# Altium project 指纹锁pcb.PrjPcb
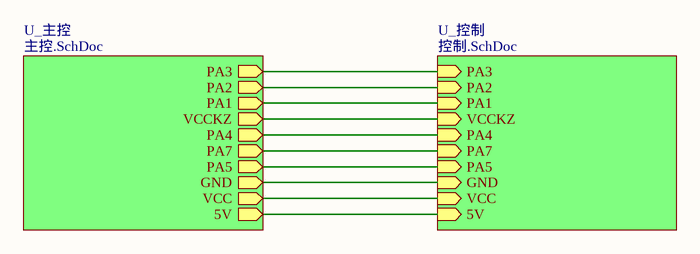
[diagram p0: 指纹锁.SchDoc]
3 sheets, 19 parts. Net scope: hierarchical (ports join the sheet entries above them; power ports are global).
Board file: 指纹锁PCB_2as.PcbDoc
Sheets:
  指纹锁.SchDoc
    U_控制 = 控制.SchDoc
    U_主控 = 主控.SchDoc

## Sheet 指纹锁.SchDoc
size A4

### Sub-sheets
U_主控 = 主控.SchDoc: PA3 (out), PA2 (out), PA1 (out), VCCKZ (out), PA4 (out), PA7 (out), PA5 (out), GND (out), VCC (out), 5V (out)
U_控制 = 控制.SchDoc: PA3 (in), PA2 (in), PA1 (in), VCCKZ (in), PA4 (in), PA7 (in), PA5 (in), GND (in), VCC (in), 5V (in)

### Nets
GND: sheet U_控制/GND, sheet U_主控/GND
VCC: sheet U_控制/VCC, sheet U_主控/VCC
5v: sheet U_控制/5V, sheet U_主控/5V
PA1: sheet U_控制/PA1, sheet U_主控/PA1
PA2: sheet U_控制/PA2, sheet U_主控/PA2
PA3: sheet U_控制/PA3, sheet U_主控/PA3
PA4: sheet U_控制/PA4, sheet U_主控/PA4
PA5: sheet U_控制/PA5, sheet U_主控/PA5
PA7: sheet U_控制/PA7, sheet U_主控/PA7
VCCKZ: sheet U_控制/VCCKZ, sheet U_主控/VCCKZ

## Sheet 控制.SchDoc
size A4
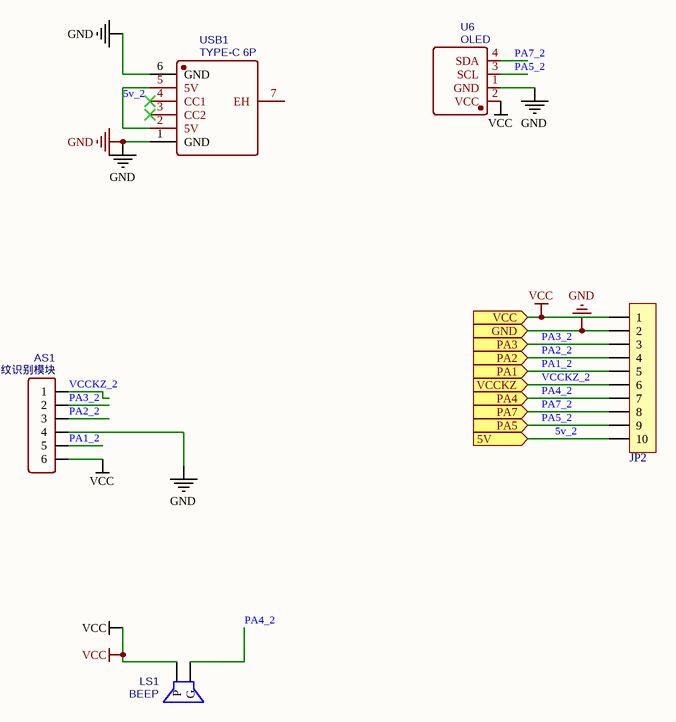
[diagram p1: 控制.SchDoc]

### Parts
AS1  指纹识别模块  [HDR2.54-WI-6P]
JP2  HDR-1X10  [MX 1.25-WI-10P]  (value not drawn)
LS1  BEEP  [BEEP 6.5x12x6]
U6  OLED  [0.96_OLED]
USB1  TYPE-C 6P  [USB-C-SMD_10P-P1.00-L6.8-W8.9]

### Ports
5V (in), GND (in), PA1 (in), PA2 (in), PA3 (in), PA4 (in), PA5 (in), PA7 (in), VCC (in), VCCKZ (in)

### Nets
GND: AS1.4 JP2.2 U6.1(GND) USB1.1(GND) USB1.6(GND) ; port GND
VCC: AS1.6 JP2.1 LS1.1(P) U6.2(VCC) ; port VCC
5v_2: JP2.10 USB1.2(5V) USB1.5(5V) ; port 5V  [project net 5v]
PA1_2: AS1.5 JP2.5 ; port PA1  [project net PA1]
PA2_2: AS1.3 JP2.4 ; port PA2  [project net PA2]
PA3_2: AS1.2 JP2.3 ; port PA3  [project net PA3]
PA4_2: JP2.7 LS1.2(G) ; port PA4  [project net PA4]
PA5_2: JP2.9 U6.3(SCL) ; port PA5  [project net PA5]
PA7_2: JP2.8 U6.4(SDA) ; port PA7  [project net PA7]
VCCKZ_2: AS1.1 JP2.6 ; port VCCKZ  [project net VCCKZ]

Not connected (* = marked no-connect by the designer): USB1 3(CC2)* 4(CC1)* 7(EH)

### Library data of the parts
AS1 = 指纹识别模块: Contributor: LCEDA_Lib; BOM_Supplier Part: C190819; BOM_Supplier: LCSC; spicePre: J; spiceSymbolName: HDR-M-2.54_1x6
JP2 = Header 10: 10P接插件; 卖家免费技术支持，联系售后: 唯一出售店铺网址https://shop463601444.taobao.com; 封装库来自淘宝卖家 ID：黄晶宝石: 其他店铺购入均为假冒，请申请退款，本店现金奖励; 优秀评价可免费更新封装库: 联系淘宝ID：黄晶宝石，获取更新版封装库; BOM名称: 10P接插件
LS1 = BEEP: Contributor: nibo; spicePre: L; spiceSymbolName: BEEP
U6 = OLED: Contributor: Sheikah; spicePre: U; spiceSymbolName: OLED
USB1 = TYPE-C 6P: BOM_Manufacturer: SHOU HAN; Contributor: youzige; BOM_Supplier: LCSC; BOM_Supplier Part: C456012; BOM_Manufacturer Part: TYPE-C 6P; spicePre: U; spiceSymbolName: TYPE-C 6P

## Sheet 主控.SchDoc
size A4
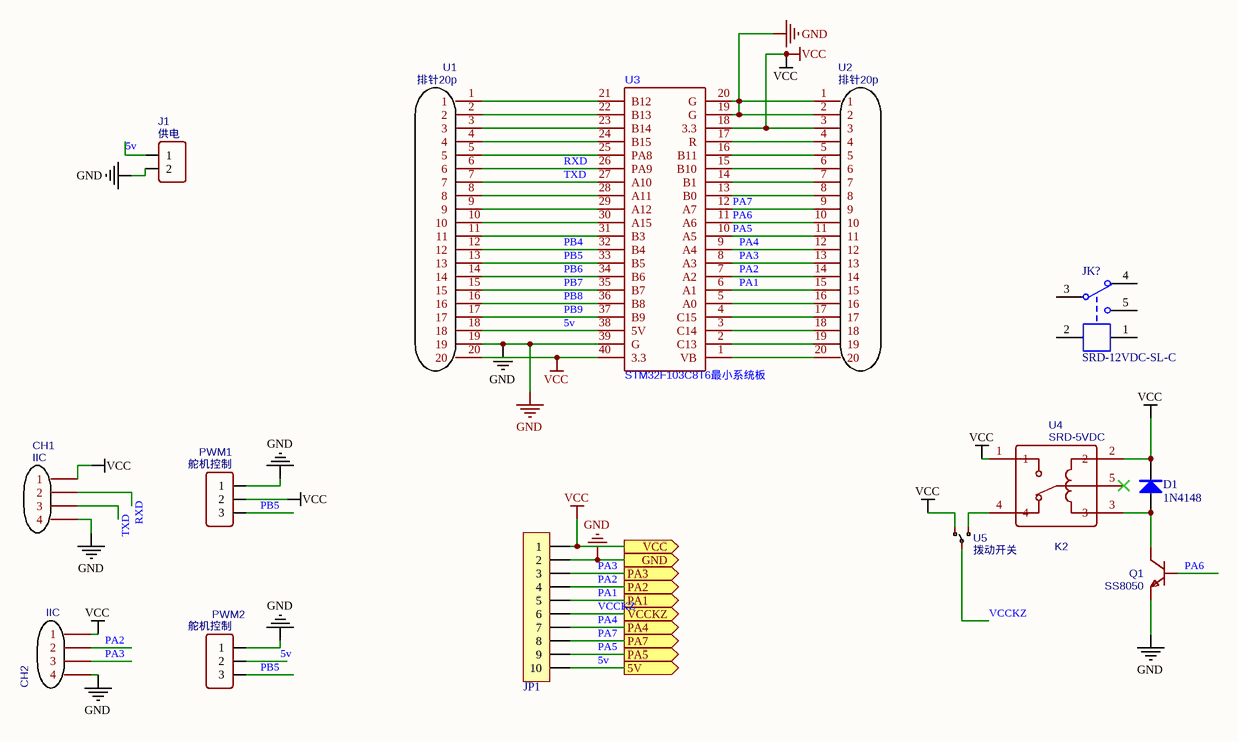
[diagram p2: 主控.SchDoc]

### Parts
CH1  IIC  [HDR2.54-LI-4P]
CH2  IIC  [HDR2.54-LI-4P]
D1  1N4148  [DO-35]
J1  供电  [HDR2.54-WI-2P]
JK?  SRD-12VDC-SL-C  [SRD-C_B]
JP1  HDR-1X10  [MX 1.25-WI-10P]  (value not drawn)
PWM1  舵机控制  [HDR2.54-WI-3P]
PWM2  舵机控制  [HDR2.54-WI-3P]
Q1  SS8050  [TO92A]
U1  排针20p  [HDR2.54-M-LI-20P]
U2  排针20p  [HDR2.54-M-LI-20P]
U3  STM32F103C8T6最小系统板  [PCBComponent_1 - duplicate]
U4  SRD-5VDC  [SRD-C_B]
U5  拨动开关  [SS12D00G3]

### Ports
5V (out), GND (out), PA1 (out), PA2 (out), PA3 (out), PA4 (out), PA5 (out), PA7 (out), VCC (out), VCCKZ (out)

### Nets
GND: CH1.4 CH2.4 J1.2 JP1.2 PWM1.1 PWM2.1 Q1.1(E) U1.19 U2.1 U2.2 U3.19(G) U3.20(G) U3.39(G) ; port GND
VCC: CH1.1 CH2.1 D1.2 JP1.1 PWM1.2 U1.20 U2.3 U3.18(3.3) U3.40(3.3) U4.1 U4.2 U5.3 ; port VCC
5v: J1.1 JP1.10 PWM2.2 U1.18 U3.38(5V) ; port 5V
PA1: JP1.5 U2.15 U3.6(A1) ; port PA1
PA2: CH2.2 JP1.4 U2.14 U3.7(A2) ; port PA2
PA3: CH2.3 JP1.3 U2.13 U3.8(A3) ; port PA3
PA4: JP1.7 U2.12 U3.9(A4) ; port PA4
PA5: JP1.9 U2.11 U3.10(A5) ; port PA5
PA6: Q1.2(B) U2.10 U3.11(A6)
PA7: JP1.8 U2.9 U3.12(A7) ; port PA7
PB4: U1.12 U3.32(B4)
PB5: PWM1.3 PWM2.3 U1.13 U3.33(B5)
PB6: U1.14 U3.34(B6)
PB7: U1.15 U3.35(B7)
PB8: U1.16 U3.36(B8)
PB9: U1.17 U3.37(B9)
RXD: CH1.2 U1.6 U3.26(PA9)
TXD: CH1.3 U1.7 U3.27(A10)
VCCKZ: JP1.6 U5.2 ; port VCCKZ
NetD1_1: D1.1 Q1.3(C) U4.3
NetU1_1: U1.1 U3.21(B12)
NetU1_2: U1.2 U3.22(B13)
NetU1_3: U1.3 U3.23(B14)
NetU1_4: U1.4 U3.24(B15)
NetU1_5: U1.5 U3.25(PA8)
NetU1_8: U1.8 U3.28(A11)
NetU1_9: U1.9 U3.29(A12)
NetU1_10: U1.10 U3.30(A15)
NetU1_11: U1.11 U3.31(B3)
NetU2_4: U2.4 U3.17(R)
NetU2_5: U2.5 U3.16(B11)
NetU2_6: U2.6 U3.15(B10)
NetU2_7: U2.7 U3.14(B1)
NetU2_8: U2.8 U3.13(B0)
NetU2_16: U2.16 U3.5(A0)
NetU2_17: U2.17 U3.4(C15)
NetU2_18: U2.18 U3.3(C14)
NetU2_19: U2.19 U3.2(C13)
NetU2_20: U2.20 U3.1(VB)
NetU4_4: U4.4 U5.1

Not connected (* = marked no-connect by the designer): JK? 1 2 3 4 5; U4 5*

### Notes on the sheet
- (in symbol SRD-5VDC) K2

### Library data of the parts
CH1 CH2 = IIC: Contributor: lzzzzzz; spicePre: U; spiceSymbolName: HANDER*4
D1 = 1N4148: 开关二极管; BOM名称: 高速开关二极管; 卖家免费技术支持，联系售后: 唯一出售店铺网址https://shop463601444.taobao.com; 优秀评价可免费更新: 联系淘宝ID：黄晶宝石，获取更新版封装库; 封装库 来自淘宝卖家 ID：黄晶宝石: 其他店铺购入均为盗版，请立即申请退款
J1 = 供电: Contributor: LCEDA_Lib; BOM_Supplier Part: C124375; BOM_Supplier: LCSC; spicePre: J; spiceSymbolName: HDR-M-2.54_1x2
JK? = SRD-12VDC-SL-C: 12V一组转换; BOM名称: 12V继电器; 版权归属: 封装库来自淘宝卖家 ID：黄晶宝石; 卖家免费技术支持，联系售后: 唯一出售店铺网址https://shop463601444.taobao.com; 封装库来自淘宝卖家 ID：黄晶宝石: 其他店铺购入均为假冒，请立即申请退款，本店现金奖励
JP1 = Header 10: as JP2 on sheet 控制; BOM名称: 10P接插件
PWM1 PWM2 = 舵机控制: Contributor: LCEDA_Lib; BOM_Supplier Part: C180248; BOM_Supplier: LCSC; spicePre: J; spiceSymbolName: HDR-M-2.54_1x3
Q1 = SS8050: BOM_Manufacturer: CJ; BOM_Supplier: LCSC; BOM_Manufacturer Part: SS8050; image: //image.lceda.cn/szlcsc/C80297.jpg; BOM_Supplier Part: C80297; spicePre: Q; spiceSymbolName: SS8050
U1 U2 = 排针20p: Contributor: liugj; spicePre: U; spiceSymbolName: 排针20p
U4 = SRD-5VDC: Contributor: Jensen; spicePre: U; spiceSymbolName: SRD-5VDC
U5 = 拨动开关: Contributor: ShiKerFamily; BOM_Supplier: LCSC; spicePre: U; spiceSymbolName: 拨动开关-SS12D00G3

## Nets that join several sheets
GND: 控制 (5 pins), 主控 (13 pins)
VCC: 控制 (AS1.6 JP2.1 LS1.1 U6.2), 主控 (12 pins)
5v: 控制 (JP2.10 USB1.2 USB1.5), 主控 (5 pins)
PA1: 控制 (AS1.5 JP2.5), 主控 (JP1.5 U2.15 U3.6)
PA2: 控制 (AS1.3 JP2.4), 主控 (CH2.2 JP1.4 U2.14 U3.7)
PA3: 控制 (AS1.2 JP2.3), 主控 (CH2.3 JP1.3 U2.13 U3.8)
PA4: 控制 (JP2.7 LS1.2), 主控 (JP1.7 U2.12 U3.9)
PA5: 控制 (JP2.9 U6.3), 主控 (JP1.9 U2.11 U3.10)
PA7: 控制 (JP2.8 U6.4), 主控 (JP1.8 U2.9 U3.12)
VCCKZ: 控制 (AS1.1 JP2.6), 主控 (JP1.6 U5.2)